# EAGLE schematic driver(mod) (EAGLE 6.5.0)
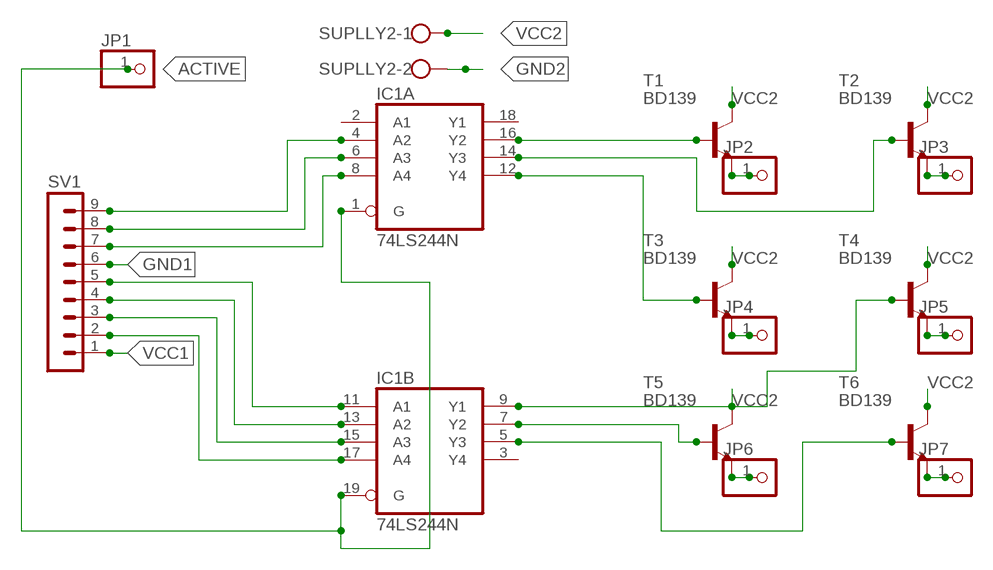
[diagram p0: schematic, sheet 1]

## Parts
IC1  74LS244N  [DIL20]
JP1  PINHD-1X1  [1X01]
JP2  PINHD-1X1  [1X01]
JP3  PINHD-1X1  [1X01]
JP4  PINHD-1X1  [1X01]
JP5  PINHD-1X1  [1X01]
JP6  PINHD-1X1  [1X01]
JP7  PINHD-1X1  [1X01]
SUPLLY2  W237-102  [W237-102]
SV1  MA09-1  [MA09-1]
T1  BD139  [TO126]
T2  BD139  [TO126]
T3  BD139  [TO126]
T4  BD139  [TO126]
T5  BD139  [TO126]
T6  BD139  [TO126]

## Nets
ACTIVE: IC1.1(A:G) IC1.19(B:G) JP1.1
GND1: SV1.6
GND2: SUPLLY2.2
N$1: IC1.4(A:A2) SV1.9
N$2: IC1.6(A:A3) SV1.8
N$3: IC1.8(A:A4) SV1.7
N$5: IC1.11(B:A1) SV1.5
N$6: IC1.13(B:A2) SV1.4
N$7: IC1.16(A:Y2) T1.3(B)
N$8: JP2.1 T1.1(E)
N$9: IC1.14(A:Y3) T2.3(B)
N$10: IC1.12(A:Y4) T3.3(B)
N$11: IC1.15(B:A3) SV1.3
N$12: IC1.9(B:Y1) T4.3(B)
N$13: IC1.7(B:Y2) T5.3(B)
N$14: JP3.1 T2.1(E)
N$15: JP4.1 T3.1(E)
N$16: JP5.1 T4.1(E)
N$17: JP6.1 T5.1(E)
N$18: JP7.1 T6.1(E)
N$20: IC1.5(B:Y3) T6.3(B)
N$21: IC1.17(B:A4) SV1.2
VCC1: SV1.1
VCC2: SUPLLY2.1 T1.2(C) T2.2(C) T3.2(C) T4.2(C) T5.2(C) T6.2(C)
Unconnected: IC1.2(A:A1) IC1.3(B:Y4) IC1.18(A:Y1)

## Power pins joined to a net without a drawn wire
GND: IC1.10(P:GND)
VCC: IC1.20(P:VCC)

## Library data of the parts
IC1 = 74xx-us:74*244: Octal BUFFER and LINE DRIVER, 3-state
JP1-JP7 = pinhead:PINHD-1X1: PIN HEADER
SUPLLY2 = con-wago-500:W237-102: WAGO SCREW CLAMP; MPN: 237-102; OC_FARNELL: unknown; OC_NEWARK: 70K9898
SV1 = con-lstb:MA09-1: PIN HEADER; OC_FARNELL: unknown; OC_NEWARK: unknown
T1-T6 = transistor:BD139: NPN TRANSISTOR